# EAGLE design Accessory - Power v3 (EAGLE 5.06)
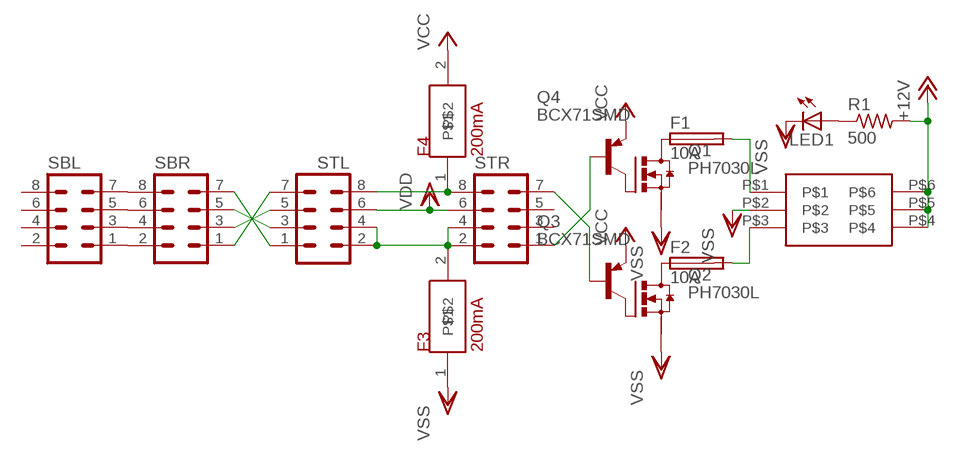
[diagram p0: schematic, sheet 1]

## Parts
F1  10A  FUSEPICOFUSE  [PICOFUSE]
F2  10A  FUSEPICOFUSE  [PICOFUSE]
F3  200mA  FUSE  [R0603]
F4  200mA  FUSE  [R0603]
LED1  LEDCHIP-LED0603  [CHIP-LED0603]
Q1  PH7030L  [SOT669]
Q2  PH7030L  [SOT669]
Q3  BCX71SMD  [SOT23]
Q4  BCX71SMD  [SOT23]
R1  500  R-US_R0603  [R0603]
SBL  MA04-2  [MA04-2]
SBR  MA04-2  [MA04-2]
STL  MA04-2  [MA04-2]
STR  MA04-2  [MA04-2]
U$1  0015246060  [015246040]

## Nets
+12V: R1.2 U$1.P$4 U$1.P$5 U$1.P$6
N$2: Q1.4(G) Q4.3(C)
N$3: Q2.4(G) Q3.3(C)
N$4: Q4.1(B) STR.1
N$5: Q3.1(B) STR.7
N$6: F2.1 Q2.MB(D)
N$7: F1.1 Q1.MB(D)
N$8: SBR.7 STL.1
N$9: SBR.5 STL.3
N$10: SBR.3 STL.5
N$11: SBR.1 STL.7
N$12: SBL.1 SBR.2
N$13: SBL.3 SBR.4
N$14: SBL.5 SBR.6
N$15: SBL.7 SBR.8
N$20: F4.1 STL.8 STR.8
N$21: F3.2 STL.2 STL.4 STR.2 STR.4
N$22: F2.2 U$1.P$3
N$23: F1.2 U$1.P$1
N$29: LED1.A R1.1
VCC: F4.2 Q3.2(E) Q4.2(E)
VDD: STL.6 STR.6
VSS: F3.1 LED1.C Q1.1(S) Q2.1(S) U$1.P$2
Unconnected: Q1.2(S) Q1.3(S) Q2.2(S) Q2.3(S) SBL.2 SBL.4 SBL.6 SBL.8 STR.3 STR.5

## Library data of the parts
F1 F2 = fuse:FUSE: Fuse
F3 F4 = rcl:FUSE
LED1 = led:LED: LED OSRAM: - CHIPLED LG R971, LG N971, LY N971, LG Q971, LY Q971, LO R971, LY R971 LH N974, LH R974 LS Q976, LO Q976, LY Q976 LO Q996 - Hyper CHIPLED LW Q18S LB Q993, LB Q99A, LB R99A - SideLED LS A670, LO A670, LY A670, LG A670, LP A670 LB A673, LV A673, LT A673, LW A673 LH A674 LY A675 LS A676, LA A676, LO A676, LY A676, LW A676 LS A679, LY A679, LG A679 - Hyper Micro SIDELED® LS Y876, LA Y876, LO Y876, LY Y876 LT Y87S - SmartLED LW L88C, LW L88S LB L89C, LB L89S, LG L890 LS L89K, LO L89K, LY L89K LS L896, LA L896, LO L896, LY L896 - TOPLED LS T670, LO T670, LY T670, LG T670, LP T670 LSG T670, LSP T670, LSY T670, LOP T670, LYG T670 LG T671, LOG T671, LSG T671 LB T673, LV T673, LT T673, LW T673 LH T674 LS T676, LA T676, LO T676, LY T676, LB T676, LH T676, LSB T676, LW T676 LB T67C, LV T67C, LT T67C, LS T67K, LO T67K, LY T67K, LW E67C LS E67B, LA E67B, LO E67B, LY E67B, LB E67C, LV E67C, LT E67C LW T67C LS T679, LY T679, LG T679 LS T770, LO T770, LY T770, LG T770, LP T770 LB T773, LV T773, LT T773, LW T773 LH T774 LS E675, LA E675, LY E675, LS T675 LS T776, LA T776, LO T776, LY T776, LB T776 LHGB T686 LT T68C, LB T68C - Hyper Mini TOPLED® LB M676 - Mini TOPLED Santana® LG M470 LS M47K, LO M47K, LY M47K Source: http://www.osram.convergy.de LUXEON: - LUMILED® LXK2-PW12-R00, LXK2-PW12-S00, LXK2-PW14-U00, LXK2-PW14-V00 LXK2-PM12-R00, LXK2-PM12-S00, LXK2-PM14-U00 LXK2-PE12-Q00, LXK2-PE12-R00, LXK2-PE12-S00, LXK2-PE14-T00, LXK2-PE14-U00 LXK2-PB12-K00, LXK2-PB12-L00, LXK2-PB12-M00, LXK2-PB14-N00, LXK2-PB14-P00, LXK2-PB14-Q00 LXK2-PR12-L00, LXK2-PR12-M00, LXK2-PR14-Q00, LXK2-PR14-R00 LXK2-PD12-Q00, LXK2-PD12-R00, LXK2-PD12-S00 LXK2-PH12-R00, LXK2-PH12-S00 LXK2-PL12-P00, LXK2-PL12-Q00, LXK2-PL12-R00 Source: www.luxeon.com KINGBRIGHT: KA-3528ASYC Source: www.kingbright.com
Q1 Q2 = transistor-power:PH7030L: N-channel TrenchMOS (TM) logic level FET Source: http://www.nxp.com/acrobat_download/datasheets/PH7030L_4.pdf
Q3 Q4 = transistor-pnp:BCX71SMD: PNP Transistor
R1 = rcl:R-US_: RESISTOR, American symbol
SBL SBR STL STR = con-lstb:MA04-2: PIN HEADER
U$1 = Power Headers:0015246060

## Board
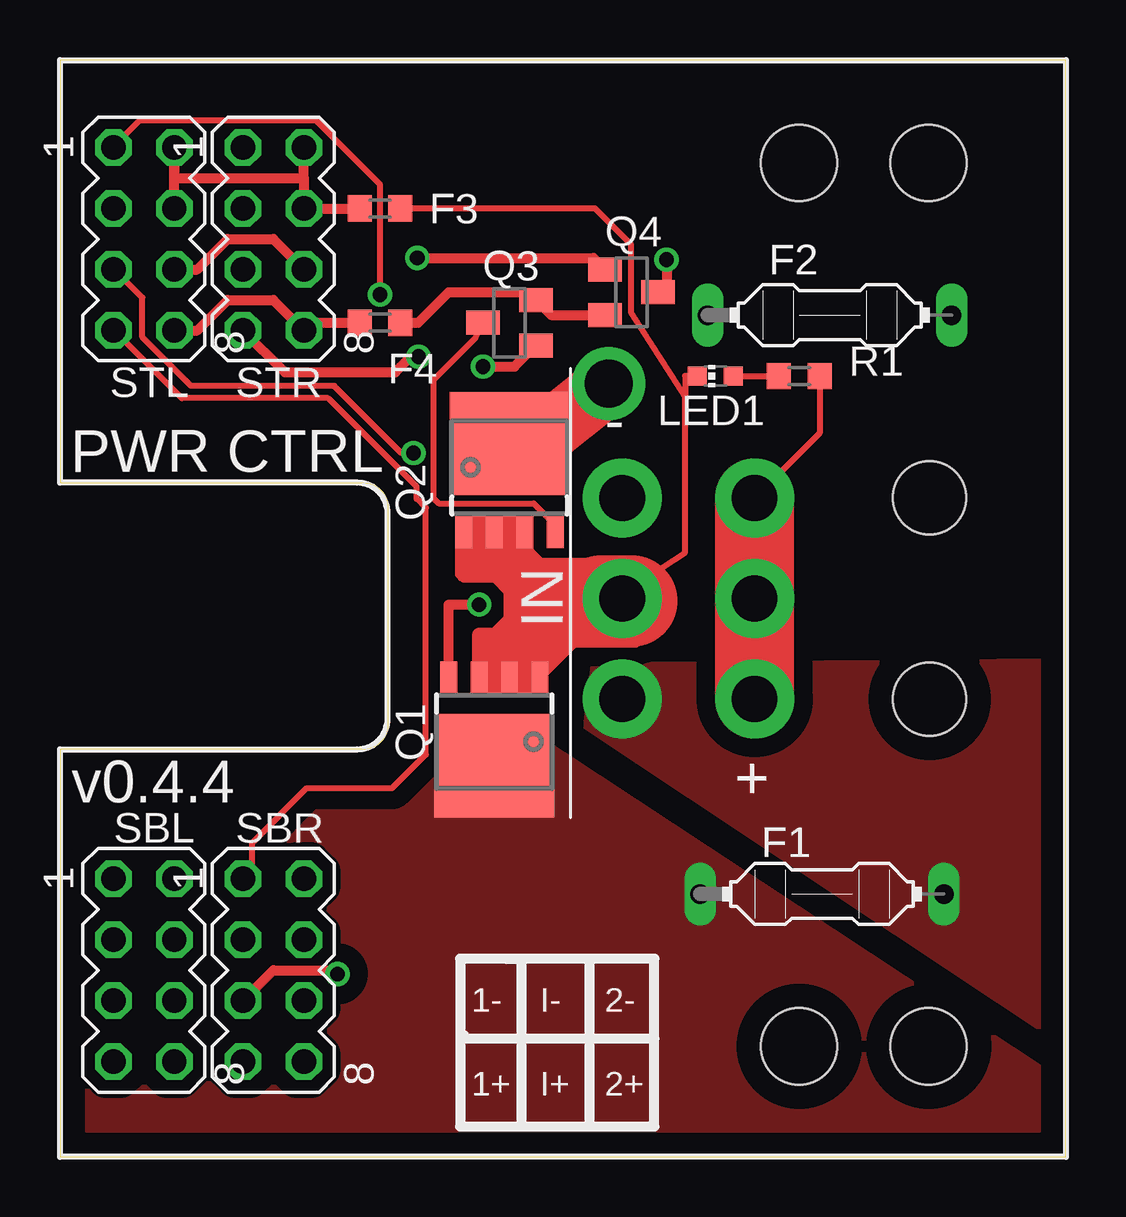
[diagram p1: board, top side]
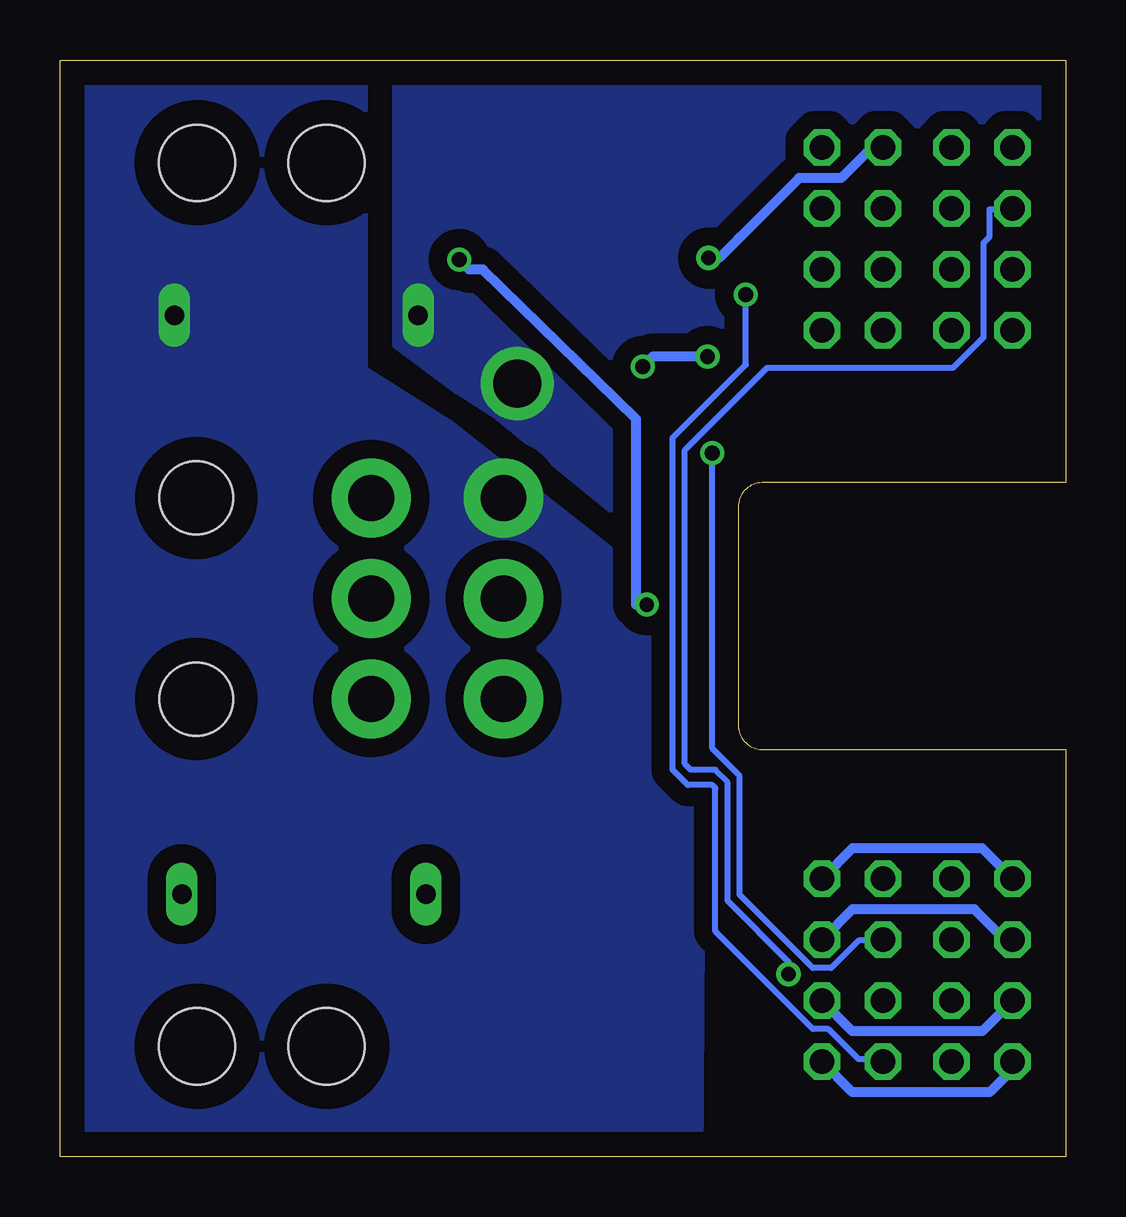
[diagram p2: board, bottom side, seen from below]

Size 41.91 x 45.72 mm. Coordinates in mm from the lower left corner, seen from the top.
Outline: 0,16.99 0,0 41.91,0 41.91,45.72 0,45.72 0,28.1 12.65,28.1 arc-90 13.65,27.1 13.65,17.99 arc-90 12.65,16.99 0,16.99
Copper layers (1*16): Top 0.035mm / dielectric 1.5mm / Bottom 0.035mm
Design rules "default *": minimum track width 10mil, minimum drill 24mil, track to track 30mil, track to pad 30mil, pad to pad 30mil, via to via 30mil, smd to smd 8mil, copper to edge 40mil, drill to drill 8mil, minimum pad ring 10mil, minimum via ring 8mil, stop-mask expansion 4mil, vias tented up to drill 0mil, thermal gap 0mil
Holes 3.17 mm at 36.2,41.43 36.2,4.6 30.8,41.43 30.8,4.6

### Footprints (pad centres in the part's own frame; a part is rotated, then mirrored left to right if it is on the bottom)
PICOFUSE = drill 0.813 long: 1 -5.08,0; 2 5.08,0
R0603 = smd 1 x 1.1: 1 -0.85,0; 2 0.85,0
CHIP-LED0603 = smd 0.8 x 0.8: A 0,-0.75; C 0,0.75
SOT669 = smd 0.7 x 1.4: 1 -1.905,-2.65; 2 -0.635,-2.65; 3 0.635,-2.65; 4 1.905,-2.65 | smd 5 x 4.3: MB 0,1
SOT23 = smd 1 x 1.4: 1 -0.95,-1.1; 2 0.95,-1.1; 3 0,1.1
MA04-2 = drill 1.016 octagon: 1 -3.81,-1.27; 2 -3.81,1.27; 3 -1.27,-1.27; 4 -1.27,1.27; 5 1.27,-1.27; 6 1.27,1.27; 7 3.81,-1.27; 8 3.81,1.27
015246040 = drill 1.905 pad 3.302 round: P$1 -8.382,4.191; P$2 -4.191,4.191; P$3 0,4.191; P$4 0,-1.321; P$5 -4.191,-1.321; P$6 -8.382,-1.321 | hole 3.048: -8.382,-8.611; 0,-8.611

### Placement (x,y rotation side)
F1  31.75,10.95 0 top
F2  32.07,35.08 0 top
F3  13.34,39.53 180 top
F4  13.34,34.77 0 top
LED1  27.3,32.54 90 top
Q1  18.1,17.3 180 top
Q2  18.73,28.73 0 top
Q3  18.73,34.77 90 top
Q4  23.81,36.04 270 top
R1  30.8,32.54 0 top
SBL  3.49,7.78 270 top
SBR  8.89,7.78 270 top
STL  3.49,38.26 270 top
STR  8.89,38.26 270 top
U$1  27.62,27.46 90 top

### Tracks (layer width: path | path; a pad name or v marks a point on that pad's centre or on a via)
+12V
  Top 0.254: R1.2 31.65,30.17 U$1.P$4
  Top 3.302: U$1.P$4 U$1.P$5 U$1.P$6
N$2  (via drill 0.6, 0.61)
  Top 0.254: 24.38,35.97 Q4.3 25.02,36.05 25.35,36.05 | Q1.4 16.15,20.43
  Top 0.406: Q1.4 16.19,23.02 v17.46,23.02 | 25.35,36.05 25.27,36.12 v25.27,37.4 | v17.46,23.02
  Bottom 0.406: v25.27,37.4 24.87,36.99 24.29,36.99 17.9,30.76 17.9,23.02 v17.46,23.02 | v17.46,23.02
N$3
  Top 0.254: Q2.4 20.62,26.09 20.62,26.35 19.74,27.23 15.79,27.23 15.58,27.44 15.58,32.4 17.31,34.13 17.63,34.75 Q3.3
N$4  (via drill 0.61)
  Top 0.254: Q4.1
  Top 0.406: Q4.1 22.23,37.47 14.92,37.47 | 14.92,37.47 | v14.88,37.47 14.92,37.47
  Bottom 0.406: STR.1 8.1,42.07 9.37,40.8 11.11,40.8 13.57,38.34 | 13.57,38.34 13.65,38.26 | v14.88,37.47 14.45,37.47 13.57,38.34
N$5  (via drill 0.61)
  Top 0.254: 19.81,33.81 Q3.1
  Top 0.406: 19.81,33.81 18.94,32.94 v17.63,32.94 | STR.7 9.37,32.7 13.97,32.7 14.62,33.36 v14.94,33.36
  Bottom 0.406: v14.94,33.36 17.21,33.36 v17.63,32.94
N$6  (via drill 2 pad 3.05)
  Top 2.54: v22.86,32.23 19.68,29.69 Q2.MB
  pour Bottom (no thermals): 27.94,47.62 -4.13,46.35 14.76,23.49 23.65,30.8 25.4,31.91 27.94,33.81
N$7
  pour Top (no thermals): 0.32,18.26 18.73,18.26 41.91,3.02 41.91,-0.48 30,-0.16 -0.16,-0.48
N$8  (via drill 0.61)
  Top 0.254: v13.34,35.94 13.34,40.51 10.67,43.18 3.3,43.18 2.29,42.16 STL.1
  Bottom 0.254: v13.34,35.94 13.34,33.02 16.38,29.97 16.38,16.13 15.75,15.49 14.73,15.49 14.61,15.37 14.61,9.4 10.54,5.33 9.91,5.33 8.64,4.06 7.62,4.06 SBR.7
N$9  (via drill 0.61)
  Top 0.406: SBR.5 | SBR.5 8.89,7.78 11.4,7.78 v11.56,7.62
  Bottom 0.254: v11.56,7.62 11.56,8.13 14.1,10.67 14.1,15.62 14.61,16.13 15.62,16.13 15.88,16.38 15.88,29.46 12.45,32.89 4.7,32.89 3.43,34.16 3.43,38.1 3.17,38.35 3.17,39.5 2.29,39.5 STL.3
N$10  (via drill 0.61)
  Top 0.254: v14.73,29.34 14.22,29.34 11.43,32.13 5.46,32.13 3.43,34.16 3.43,35.81 2.29,36.96 STL.5
  Bottom 0.254: SBR.3 7.62,9.02 8.64,9.02 9.78,7.87 10.54,7.87 13.59,10.92 13.59,15.88 14.73,17.02 v14.73,29.34
N$11
  Top 0.254: SBR.1 7.62,11.68 8,12.06 8,13.08 10.29,15.37 13.84,15.37 15.24,16.76 15.24,27.05 14.86,27.43 14.86,27.94 11.18,31.62 5.08,31.62 2.29,34.42 STL.7
N$12
  Bottom 0.406: SBL.1 3.49,12.86 8.89,12.86 SBR.2
N$13
  Bottom 0.406: SBL.3 2.54,9.05 3.81,10.32 8.89,10.32 SBR.4
N$14
  Bottom 0.406: SBL.5 3.49,5.24 8.89,5.24 SBR.6
N$15
  Bottom 0.406: SBL.7 2.22,3.65 3.17,2.7 8.89,2.7 SBR.8
N$20
  Top 0.254: F4.1 12.47,34.75
  Top 0.406: STL.8 5.71,34.45 6.99,35.72 8.89,35.72 STR.8 10.16,34.77 F4.1
N$21
  Top 0.406: STL.4 STL.2 4.76,40.8 10.16,40.8 | 10.16,40.8 STR.4 F3.2 | 10.16,40.8 STR.2
N$22
  pour Bottom (no thermals): 15.08,22.38 15.24,-0.48 41.43,-0.16 41.28,46.51 29.21,46.2 29.21,32.86 25.72,30.64 15.24,22.38
N$23
  pour Top (no thermals): 41.28,5.08 41.43,20.64 22.23,20.48 21.91,17.94
N$25
  Top 0.61: 20.64,21.43 20.95,21.75
N$26
  Top 0.813: 18.26,24.29 18.89,23.65 18.89,22.86 | 18.89,22.86 18.89,22.54 | 18.89,22.86 18.89,22.38 18.1,21.59
N$27
  Top 3.81: 23.18,23.18 22.86,23.18 | 22.54,23.18 23.18,23.18 | 23.18,23.18 23.81,23.18
N$28
  Top 0.61: 17.14,25.24 17.14,25.88
N$29
  Top 0.254: LED1.A R1.1 | R1.1
N$30
  Top 0.406: 21.91,21.59 arc-90 22.23,21.75 22.54,21.75 22.38,21.59 22.23,21.59 | 21.91,21.59 21.43,21.43 23.97,21.43 | 21.91,24.61 22.23,24.77 24.13,24.77 | 24.13,24.77 24.29,24.77 24.77,23.81 24.61,23.97 24.13,24.77 | 24.13,24.77 23.81,24.61 | 21.59,21.75 21.91,21.59 | 21.91,21.59 22.23,21.59 | 22.23,21.59 24.13,21.59 24.77,22.07 | 19.05,23.65 19.05,23.81 | 19.05,22.38 19.05,23.65 | 19.05,22.07 19.05,22.38 | 19.05,22.38 18.57,21.91 | 19.05,23.65 | 19.05,23.65 18.57,24.13 | 18.57,24.13 18.26,24.45 | 18.57,24.13 18.73,24.13 | 18.57,24.13 16.83,24.13 16.67,24.29 16.67,25.4
  Top 0.61: 23.81,23.02 22.23,23.02 22.54,22.7 23.81,22.7 24.13,23.02 24.77,23.34 22.23,23.34 21.91,23.02 | 21.91,23.02 21.91,23.34 22.23,23.65 24.13,23.65 24.77,23.02 24.45,23.02 23.81,22.38 22.54,22.38 21.91,23.02 | 21.91,23.02 21.91,22.38 22.23,22.07 24.13,22.07 25.08,23.02 24.92,23.34 24.45,23.97 21.91,23.97 | 21.91,24.29 21.59,24.29 21.59,24.61 21.91,24.61 22.86,24.61 22.86,24.29 | 21.91,24.29 24.77,24.29 25.08,23.65 25.08,22.86 24.77,22.07 24.45,21.75 21.91,21.75 21.59,22.07 21.59,22.7 | 20,24.61 20.32,24.29 | 19.68,24.61 20,24.61 | 19.37,20.8 19.37,20.48 | 19.37,20.8 18.41,20.8 | 19.37,20.8 19.37,21.11 18.1,21.11 18.1,20.16 19.68,20.16 19.68,21.43 17.78,21.43 17.78,19.84 20,19.84 20,20.16 | 20,24.61 20.64,24.61 20.64,24.29 20.95,23.97 20.95,24.61 21.27,24.61 | 22.86,24.29 21.91,24.29 | 22.86,24.29 22.86,23.97 21.91,23.97 | 22.86,24.29 23.18,24.29 | 20.64,22.38 20.32,22.07 arc-135 20.13,22.52 20.64,23.02 | 20.64,22.38 20.95,22.7 | 16.83,26.19 16.83,24.92 19.05,24.92 | 21.91,23.97 21.59,23.65 21.59,22.7 | 21.91,23.97 21.27,23.97 21.27,24.61 | 20.64,23.34 19.68,24.29 | 19.68,24.29 19.05,24.92 | 19.05,24.92 19.37,24.92 | 21.59,21.75 20.95,21.11 20.32,21.11 20,20.8 20,20.16 | 20.95,22.07 20.32,21.43 | 20.95,22.07 20,22.07 | 20.95,22.07 21.59,22.7 | 21.27,23.02 21.27,24.61 | 21.27,23.02 20.64,23.65 | 20.64,23.65 19.68,24.61 | 19.68,24.61 19.37,24.92 | 20.64,23.02 21.27,23.02 | 21.27,23.02 21.27,22.07 | 21.27,22.07 20.95,22.07 | 21.27,22.07 21.27,21.43 20,20.16 | 20,20.16 20,21.75 19.05,21.75 | 18.73,21.75 19.05,21.75 | 18.73,21.75 arc193 19.05,24.61 | 18.73,21.75 17.46,21.75 17.46,19.53 20,19.53 | 19.37,25.24 19.37,24.92
  Top 0.61: 19.37,25.56 19.37,26.51 19.05,26.51 | 19.37,25.56 19.37,25.24 | 19.05,26.51 16.83,26.51 16.83,24.61 17.78,24.61 | 18.1,24.61 17.78,24.61 | 19.05,24.61 18.41,24.61 | 18.41,24.61 18.1,24.61 | 19.05,24.61 19.05,25.24 | 19.05,25.24 19.05,26.51 | 19.05,26.51 17.14,26.51 17.14,26.19 17.46,26.19 17.46,25.24 19.05,25.24 | 19.05,25.24 18.41,25.24 18.41,26.19 18.73,26.19 18.73,25.56 18.1,25.56 18.1,26.19 | 19.37,25.24 20,24.61 | 20.64,23.02 20.64,22.38 | 19.68,23.97 20.64,23.02 | 19.05,24.61 19.68,23.97 | 20.64,23.34 20.64,23.65 | 19.05,21.75 20,22.7 | 20,22.7 20.64,23.34 | 19.68,23.97 18.1,24.61 | 19.68,24.29 19.68,22.07 19.37,22.07 19.37,22.38 | 19.37,22.38 19.37,23.65 18.73,24.29 | 18.41,24.61 18.73,24.29 | 18.73,21.75 19.05,22.07 19.37,22.38 | 18.73,24.29 17.78,24.61 | 20,22.7 20,23.34 | 19.68,24.61 19.37,25.56
N$31
  Top 0.406: 21.91,24.77 21.75,24.77 20,24.77 19.53,25.24 19.53,26.35
VCC
  Top 0.254: F4.2 | 19.71,35.69 Q3.2
  Top 0.406: Q3.2 20.46,35.09 Q4.2 | 19.71,35.69 19.37,36.04 16.19,36.04 14.92,34.77 F4.2
VDD
  Top 0.406: STL.6 5.71,36.99 6.99,38.26 8.89,38.26 STR.6
VSS
  Top 0.254: 26.05,31.68 23.8,35.2 23.8,38.03 22.3,39.53 F3.1 | 26.05,31.68 26.05,25.19 24.21,23.98 U$1.P$2 | Q2.1 19.37,26.08 19.37,24.61 23.75,24.61 U$1.P$2 | Q1.1 20,20.8 22.54,23.34 23.69,23.34 U$1.P$2 | LED1.C 26.05,32.54 26.05,31.68

### Text on the board
tNames: PWR CTRL | - | IN | v0.4.4 | + | 1- | I- | 2- | 1+ | I+ | 2+